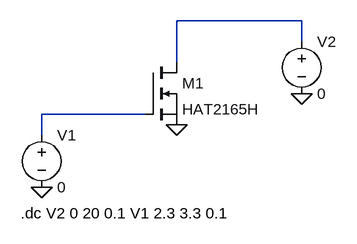
[diagram p0: schematic Draft2.asc]
Draft2.asc, the LTspice schematic file:
Version 4
SHEET 1 880 680
WIRE 544 -16 352 -16
WIRE 544 16 544 -16
WIRE 352 48 352 -16
WIRE 304 128 144 128
WIRE 144 160 144 128
FLAG 144 240 0
FLAG 544 96 0
FLAG 352 144 0
SYMBOL voltage 144 144 R0
WINDOW 123 0 0 Left 0
WINDOW 39 0 0 Left 0
SYMATTR InstName V1
SYMATTR Value 0
SYMBOL voltage 544 0 R0
WINDOW 123 0 0 Left 0
WINDOW 39 0 0 Left 0
SYMATTR InstName V2
SYMATTR Value 0
SYMBOL nmos 304 48 R0
SYMATTR InstName M1
SYMATTR Value HAT2165H
TEXT 112 280 Left 2 !.dc V2 0 20 0.1 V1 2.3 3.3 0.1

The netlist it stands for:
* Draft2.asc
V1 N002 0 0
V2 N001 0 0
M1 N001 N002 0 0 HAT2165H
.model NMOS NMOS
.model PMOS PMOS
.lib standard.mos
.dc V2 0 20 0.1 V1 2.3 3.3 0.1
.backanno
.end